# EAGLE schematic 2021-01-12_HALO_Main_Board (EAGLE 9.6.2)
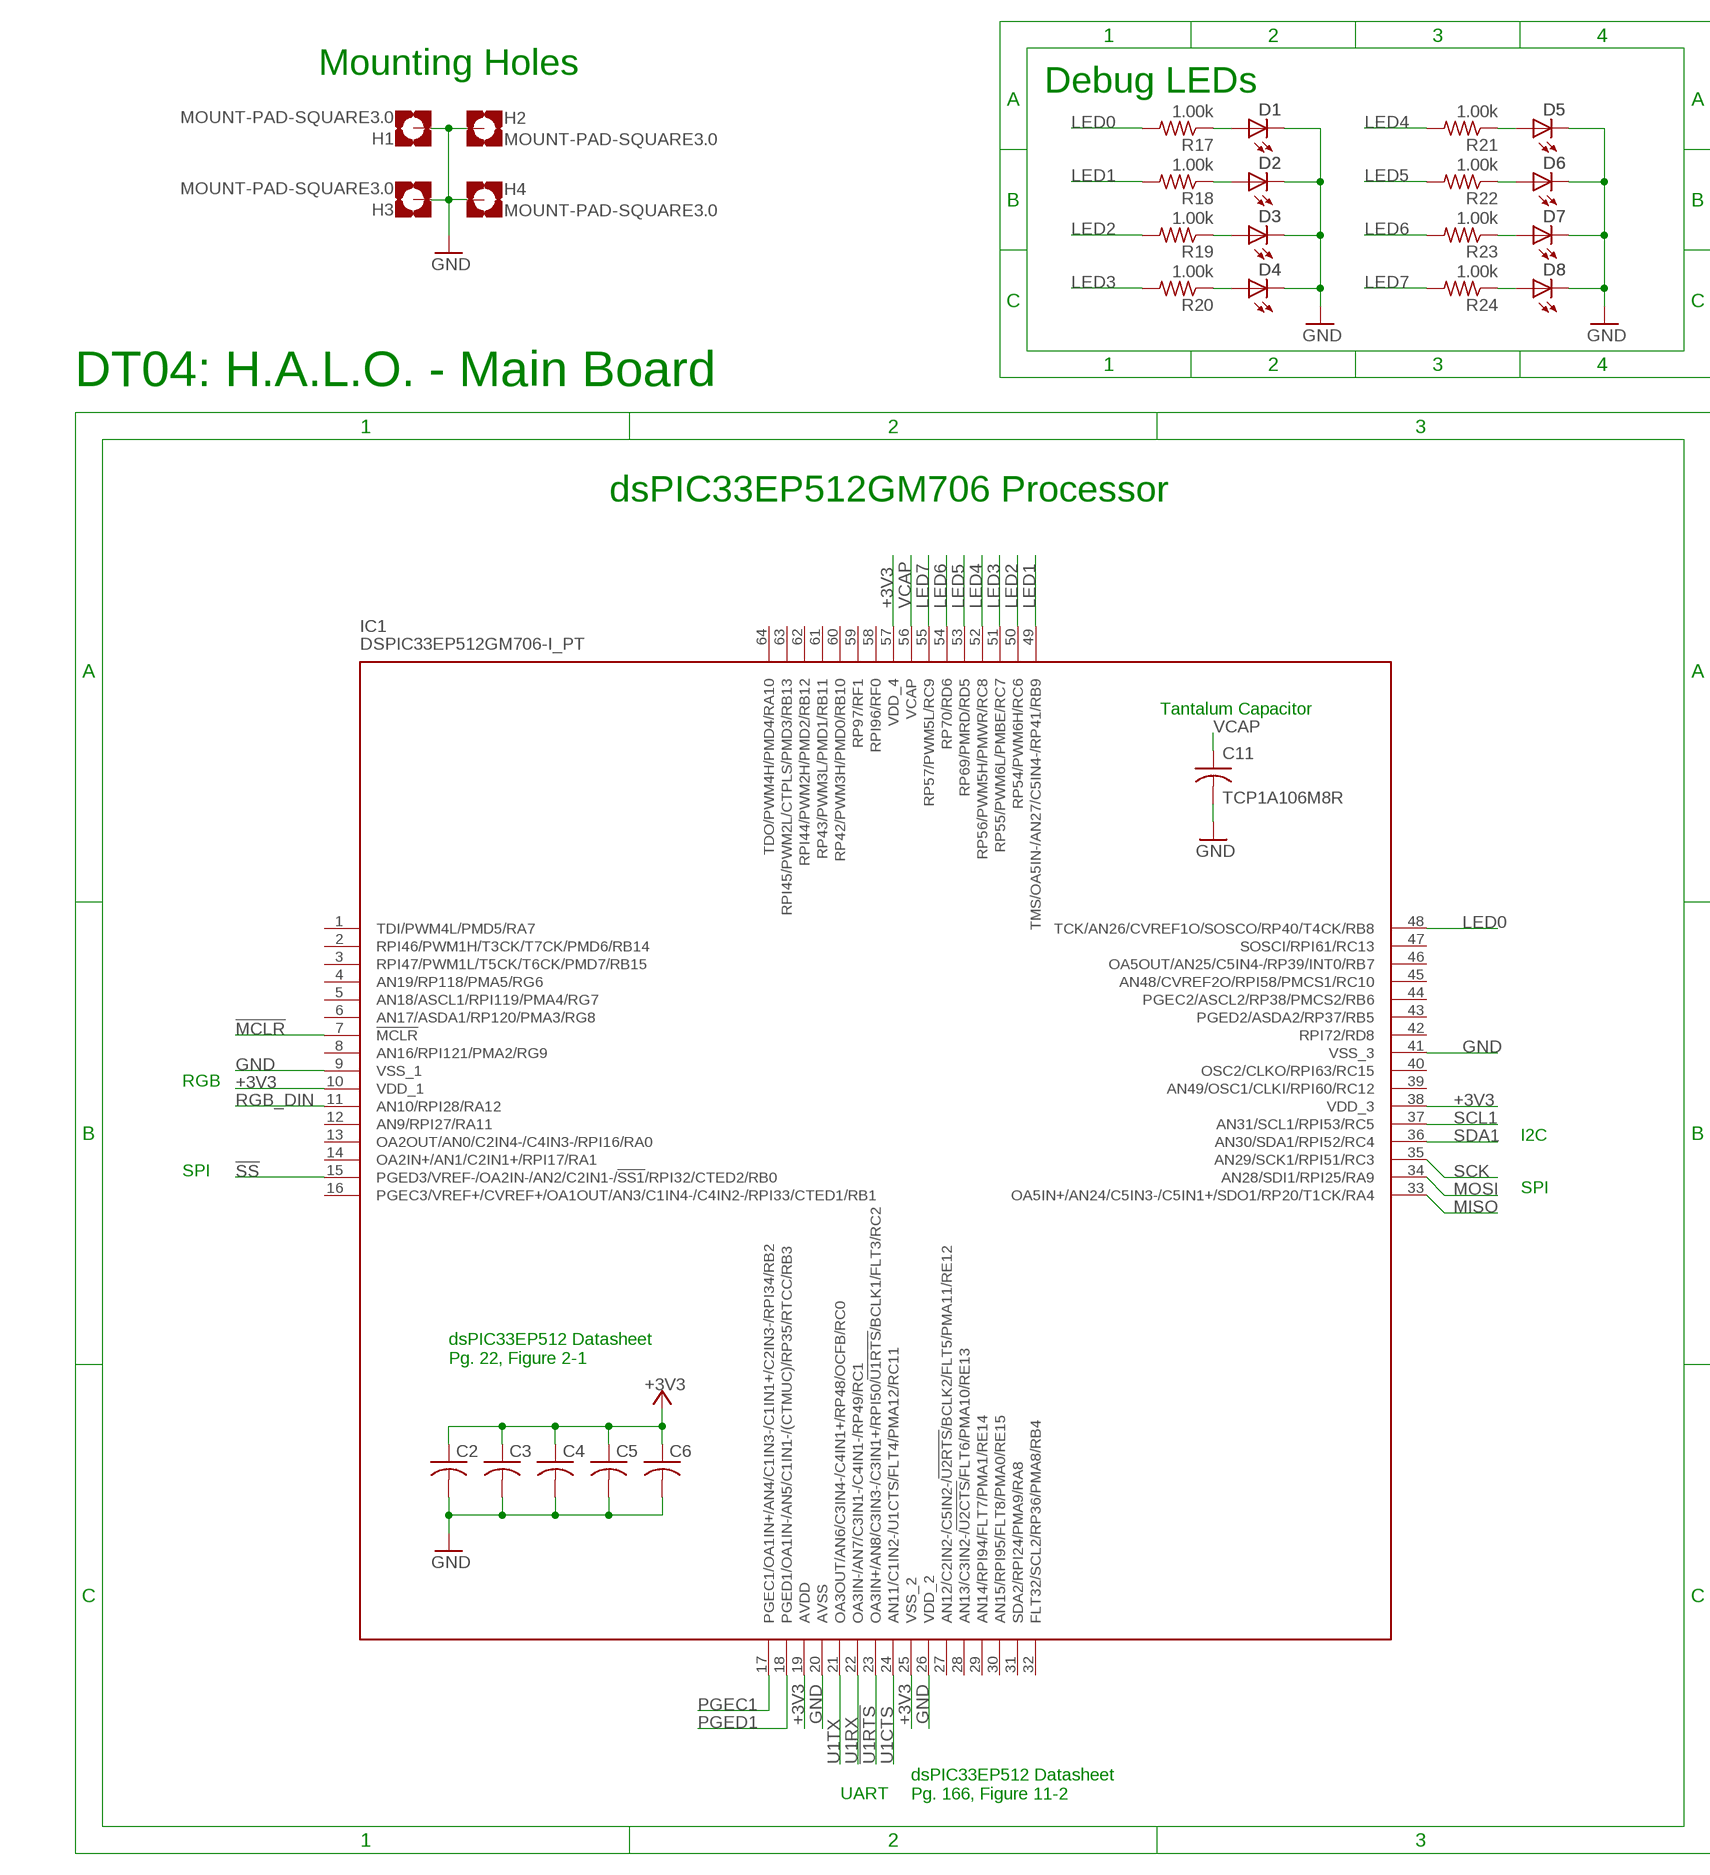
[diagram p0: schematic, sheet 1, part 1 of 2]
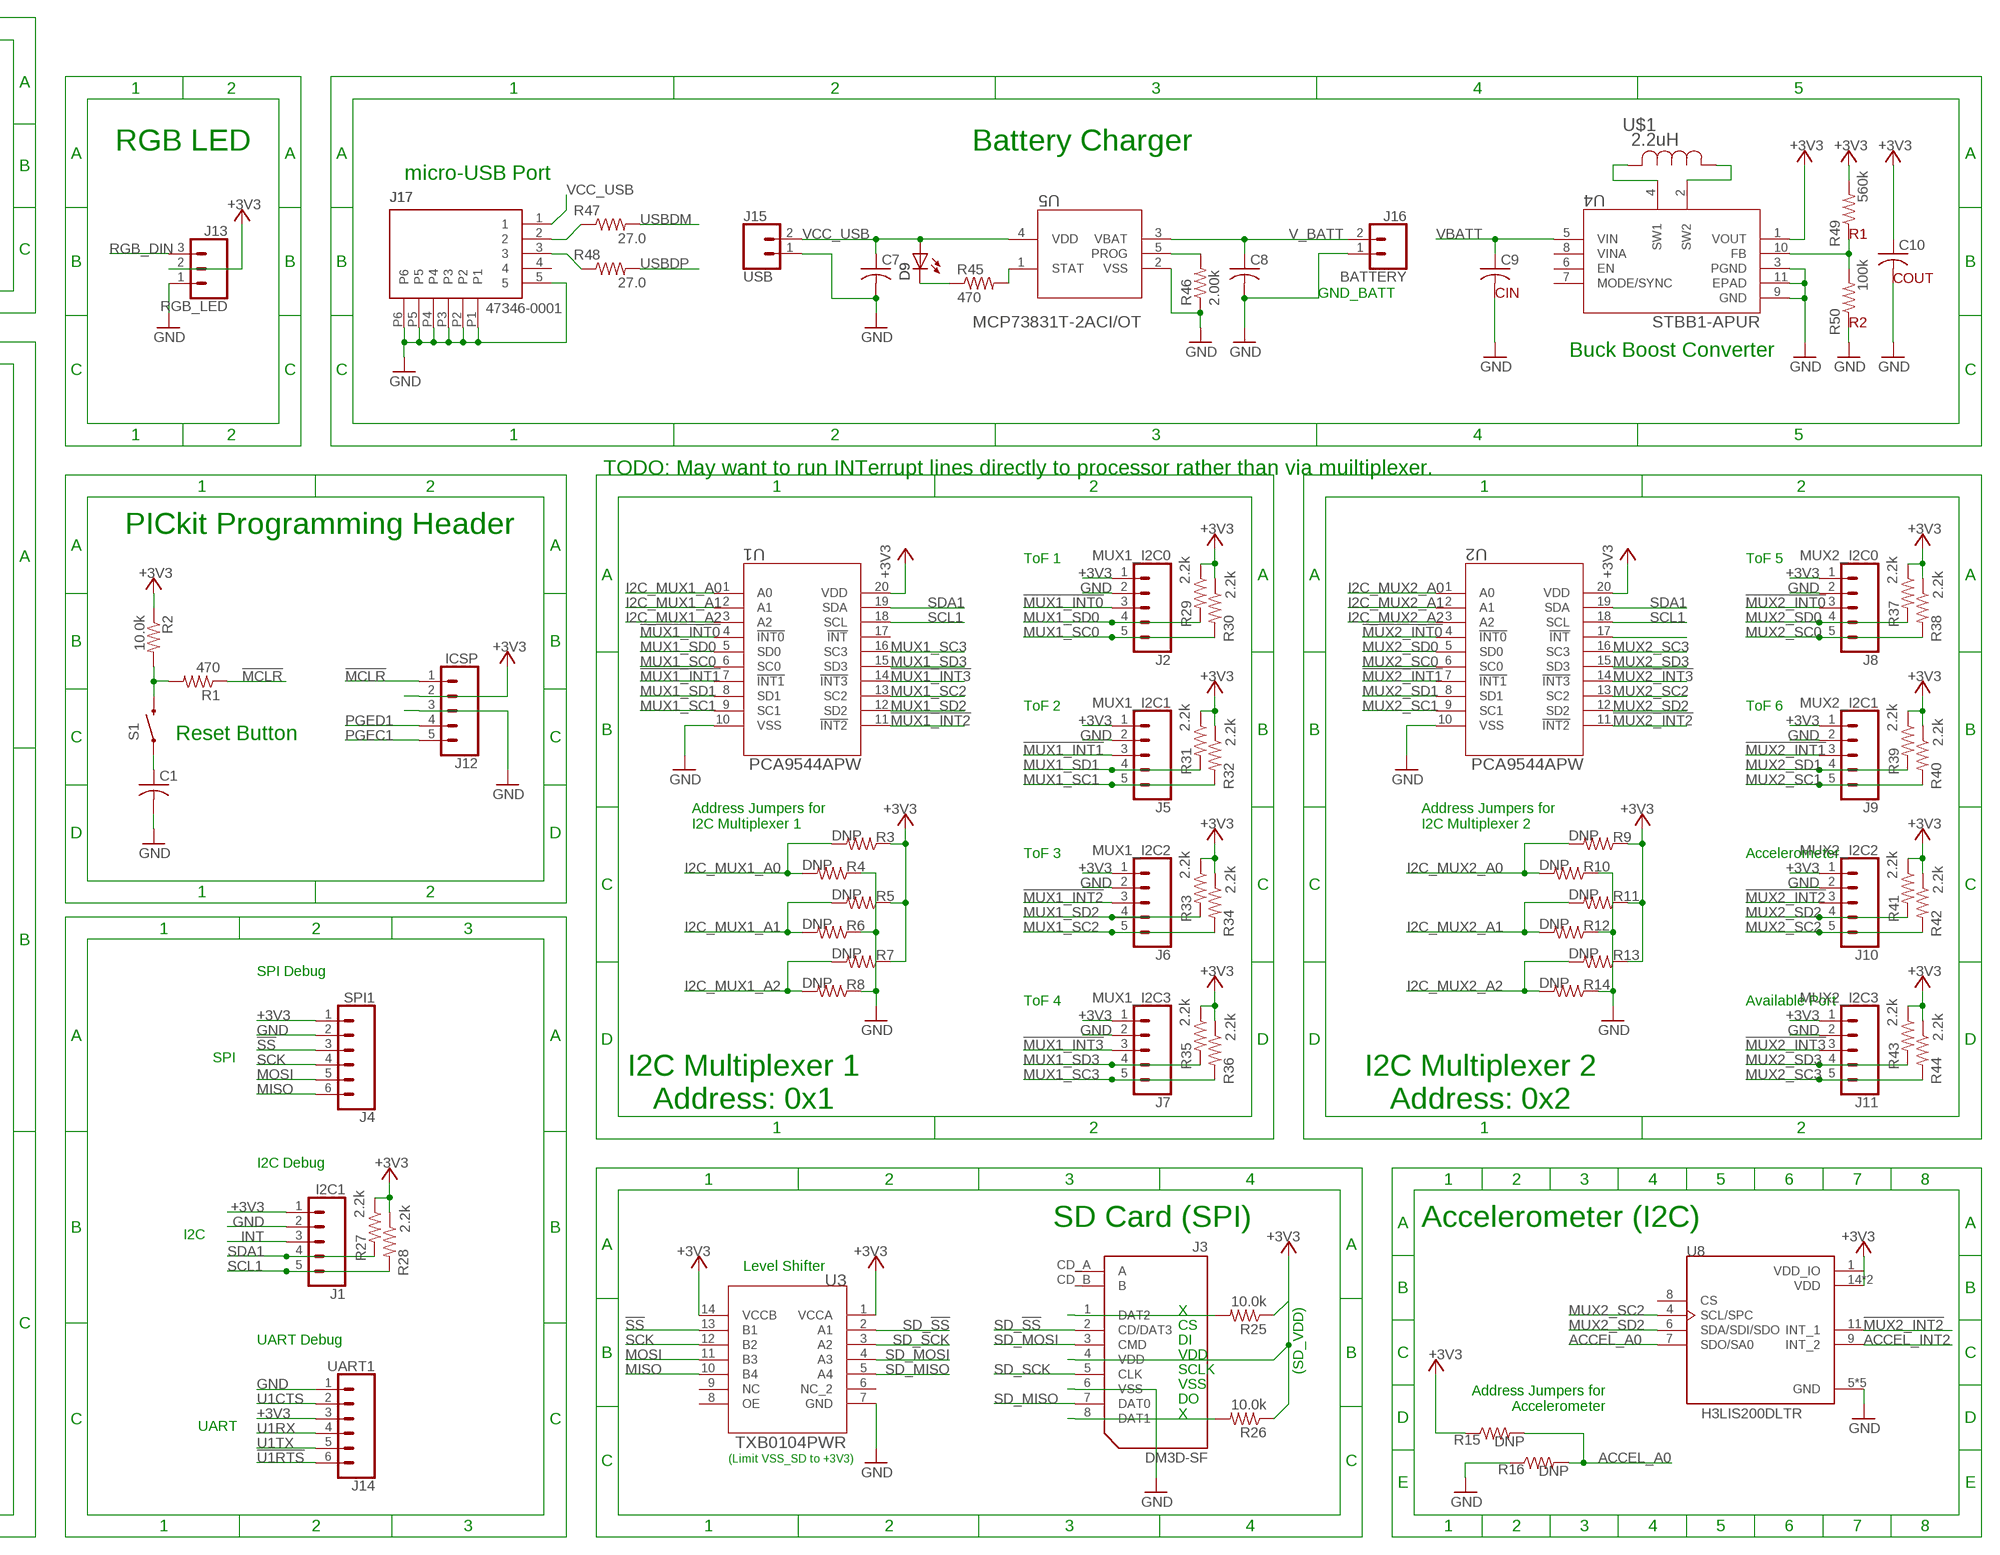
[diagram p1: schematic, sheet 1, part 2 of 2]

## Parts
C1  0.1uF  C-USC0805  [C0805]
C2  0.1uF  C-USC0805  [C0805]
C3  0.1uF  C-USC0805  [C0805]
C4  0.1uF  C-USC0805  [C0805]
C5  0.1uF  C-USC0805  [C0805]
C6  0.1uF  C-USC0805  [C0805]
C7  4.7uF  C-USC0805  [C0805]
C8  4.7uF  C-USC0805  [C0805]
C9  10uF  C-USC0805  [C0805]
C10  22uF  C-USC0805  [C0805]
C11  TCP1A106M8R  [TCP_ROM]
D1  CHIP-LED0805  [CHIP-LED0805]
D2  CHIP-LED0805  [CHIP-LED0805]
D3  CHIP-LED0805  [CHIP-LED0805]
D4  CHIP-LED0805  [CHIP-LED0805]
D5  CHIP-LED0805  [CHIP-LED0805]
D6  CHIP-LED0805  [CHIP-LED0805]
D7  CHIP-LED0805  [CHIP-LED0805]
D8  CHIP-LED0805  [CHIP-LED0805]
D9  CHIP-LED0805  [CHIP-LED0805]
H1  MOUNT-PAD-SQUARE3.0  [3,0-PAD-SQUARE]
H2  MOUNT-PAD-SQUARE3.0  [3,0-PAD-SQUARE]
H3  MOUNT-PAD-SQUARE3.0  [3,0-PAD-SQUARE]
H4  MOUNT-PAD-SQUARE3.0  [3,0-PAD-SQUARE]
IC1  DSPIC33EP512GM706-I_PT  [QFP50P1200X1200X120-64N]
J1  I2C1  CONN_05  [1X05]
J2  MUX1_I2C0  CONN_05  [1X05]
J3  DM3D-SF  AS-ITM-00047  [SD_CARD]
J4  SPI1  CONN_06SILK_FEMALE_PTH  [1X06]
J5  MUX1_I2C1  CONN_05  [1X05]
J6  MUX1_I2C2  CONN_05  [1X05]
J7  MUX1_I2C3  CONN_05  [1X05]
J8  MUX2_I2C0  CONN_05  [1X05]
J9  MUX2_I2C1  CONN_05  [1X05]
J10  MUX2_I2C2  CONN_05  [1X05]
J11  MUX2_I2C3  CONN_05  [1X05]
J12  ICSP  CONN_05  [1X05]
J13  RGB_LED  CONN_03LOCK  [1X03_LOCK]
J14  UART1  CONN_06SILK_FEMALE_PTH  [1X06]
J15  USB  CONN_02  [1X02]
J16  BATTERY  CONN_02  [1X02]
J17  47346-0001  AS-ITM-00021  [MICRO_USB]
R1  470  R-US_R0805  [R0805]
R2  10.0k  R-US_R0805  [R0805]
R3  DNP  R-US_R0805  [R0805]
R4  DNP  R-US_R0805  [R0805]
R5  DNP  R-US_R0805  [R0805]
R6  DNP  R-US_R0805  [R0805]
R7  DNP  R-US_R0805  [R0805]
R8  DNP  R-US_R0805  [R0805]
R9  DNP  R-US_R0805  [R0805]
R10  DNP  R-US_R0805  [R0805]
R11  DNP  R-US_R0805  [R0805]
R12  DNP  R-US_R0805  [R0805]
R13  DNP  R-US_R0805  [R0805]
R14  DNP  R-US_R0805  [R0805]
R15  DNP  R-US_R0805  [R0805]
R16  DNP  R-US_R0805  [R0805]
R17  1.00k  R-US_R0805  [R0805]
R18  1.00k  R-US_R0805  [R0805]
R19  1.00k  R-US_R0805  [R0805]
R20  1.00k  R-US_R0805  [R0805]
R21  1.00k  R-US_R0805  [R0805]
R22  1.00k  R-US_R0805  [R0805]
R23  1.00k  R-US_R0805  [R0805]
R24  1.00k  R-US_R0805  [R0805]
R25  10.0k  R-US_R0805  [R0805]
R26  10.0k  R-US_R0805  [R0805]
R27  2.2k  R-US_R0805  [R0805]
R28  2.2k  R-US_R0805  [R0805]
R29  2.2k  R-US_R0805  [R0805]
R30  2.2k  R-US_R0805  [R0805]
R31  2.2k  R-US_R0805  [R0805]
R32  2.2k  R-US_R0805  [R0805]
R33  2.2k  R-US_R0805  [R0805]
R34  2.2k  R-US_R0805  [R0805]
R35  2.2k  R-US_R0805  [R0805]
R36  2.2k  R-US_R0805  [R0805]
R37  2.2k  R-US_R0805  [R0805]
R38  2.2k  R-US_R0805  [R0805]
R39  2.2k  R-US_R0805  [R0805]
R40  2.2k  R-US_R0805  [R0805]
R41  2.2k  R-US_R0805  [R0805]
R42  2.2k  R-US_R0805  [R0805]
R43  2.2k  R-US_R0805  [R0805]
R44  2.2k  R-US_R0805  [R0805]
R45  470  R-US_R0805  [R0805]
R46  2.00k  R-US_R0805  [R0805]
R47  27.0  R-US_R0805  [R0805]
R48  27.0  R-US_R0805  [R0805]
R49  560k  R-US_R0805  [R0805]
R50  100k  R-US_R0805  [R0805]
S1  SWITCH-MOMENTARY-2SMD-4  [TACTILE_SWITCH_TALL]
U1  PCA9544APW  [SOT360-1_NXP]
U2  PCA9544APW  [SOT360-1_NXP]
U3  TXB0104PWR  [PW14]
U4  STBB1-APUR  [SON_B1-APUR_STM]
U5  MCP73831T-2ACI/OT  [SOT-23-5_MC_MCH]
U8  H3LIS200DLTR  [PQFN50P300X300X100-16N]
U$1  2.2uH  IND  [IND_4028_TDK]

## Nets
!MCLR: IC1.7(!MCLR) J12.1 R1.1
!MUX1_INT0: J2.3 U1.4(!INT0)
!MUX1_INT1: J5.3 U1.7(!INT1)
!MUX1_INT2: J6.3 U1.11(!INT2)
!MUX1_INT3: J7.3 U1.14(!INT3)
!MUX2_INT0: J8.3 U2.4(!INT0)
!MUX2_INT1: J9.3 U2.7(!INT1)
!MUX2_INT2: J10.3 U2.11(!INT2) U8.11(INT_1)
!MUX2_INT3: J11.3 U2.14(!INT3)
!SS: IC1.15(PGED3/VREF-/OA2IN-/AN2/C2IN1-/!SS1!/RPI32/CTED2/RB0) J4.3 U3.13(B1)
!U1RTS: IC1.23(OA3IN+/AN8/C3IN3-/C3IN1+/RPI50/!U1RTS!/BCLK1/FLT3/RC2) J14.6
+3V3: C2.1 C3.1 C4.1 C5.1 C6.1 C10.1 IC1.10(VDD_1) IC1.19(AVDD) IC1.25(VSS_2) IC1.38(VDD_3) IC1.57(VDD_4) J1.1 J2.1 J3.4(VDD) J4.1 J5.1 J6.1 J7.1 J8.1 J9.1 J10.1 J11.1 J12.2 J13.2 J14.3 R2.1 R3.1 R5.1 R7.1 R9.1 R11.1 R13.1 R15.1 R25.1 R26.1 R27.1 R28.1 R29.1 R30.1 R31.1 R32.1 R33.1 R34.1 R35.1 R36.1 R37.1 R38.1 R39.1 R40.1 R41.1 R42.1 R43.1 R44.1 R49.2 U1.20(VDD) U2.20(VDD) U3.1(VCCA) U3.14(VCCB) U4.1(VOUT) U8.1(VDD_IO) U8.14(VDD) U8.15(VDD)
ACCEL_A0: R15.2 R16.2 U8.7(SDO/SA0)
ACCEL_INT2: U8.9(INT_2)
GND: C1.2 C2.2 C3.2 C4.2 C5.2 C6.2 C7.2 C8.2 C9.2 C10.2 C11.2 D1.C D2.C D3.C D4.C D5.C D6.C D7.C D8.C H1.B3,0(MOUNT) H2.B3,0(MOUNT) H3.B3,0(MOUNT) H4.B3,0(MOUNT) IC1.9(VSS_1) IC1.20(AVSS) IC1.26(VDD_2) IC1.41(VSS_3) J1.2 J2.2 J3.6(VSS) J4.2 J5.2 J6.2 J7.2 J8.2 J9.2 J10.2 J11.2 J12.3 J13.1 J14.1 J15.1 J16.1 J17.5 J17.P1 J17.P2 J17.P3 J17.P4 J17.P5 J17.P6 R4.1 R6.1 R8.1 R10.1 R12.1 R14.1 R16.1 R46.1 R50.1 U1.10(VSS) U2.10(VSS) U3.7(GND) U4.3(PGND) U4.9(GND) U4.11(EPAD) U5.2(VSS) U8.5(GND) U8.10(GND) U8.12(GND) U8.13(GND) U8.16(GND)
I2C_MUX1_A0: R3.2 R4.2 U1.1(A0)
I2C_MUX1_A1: R5.2 R6.2 U1.2(A1)
I2C_MUX1_A2: R7.2 R8.2 U1.3(A2)
I2C_MUX2_A0: R9.2 R10.2 U2.1(A0)
I2C_MUX2_A1: R11.2 R12.2 U2.2(A1)
I2C_MUX2_A2: R13.2 R14.2 U2.3(A2)
INT: J1.3
LED0: IC1.48(TCK/AN26/CVREF1O/SOSCO/RP40/T4CK/RB8) R17.2
LED1: IC1.49(TMS/OA5IN-/AN27/C5IN4-/RP41/RB9) R18.2
LED2: IC1.50(RP54/PWM6H/RC6) R19.2
LED3: IC1.51(RP55/PWM6L/PMBE/RC7) R20.2
LED4: IC1.52(RP56/PWM5H/PMWR/RC8) R21.2
LED5: IC1.53(RP69/PMRD/RD5) R22.2
LED6: IC1.54(RP70/RD6) R23.2
LED7: IC1.55(RP57/PWM5L/RC9) R24.2
MISO: IC1.33(OA5IN+/AN24/C5IN3-/C5IN1+/SDO1/RP20/T1CK/RA4) J4.6 U3.10(B4)
MOSI: IC1.34(AN28/SDI1/RPI25/RA9) J4.5 U3.11(B3)
MUX1_SC0: J2.5 R30.2 U1.6(SC0)
MUX1_SC1: J5.5 R32.2 U1.9(SC1)
MUX1_SC2: J6.5 R34.2 U1.13(SC2)
MUX1_SC3: J7.5 R36.2 U1.16(SC3)
MUX1_SD0: J2.4 R29.2 U1.5(SD0)
MUX1_SD1: J5.4 R31.2 U1.8(SD1)
MUX1_SD2: J6.4 R33.2 U1.12(SD2)
MUX1_SD3: J7.4 R35.2 U1.15(SD3)
MUX2_SC0: J8.5 R38.2 U2.6(SC0)
MUX2_SC1: J9.5 R40.2 U2.9(SC1)
MUX2_SC2: J10.5 R42.2 U2.13(SC2) U8.4(SCL/SPC)
MUX2_SC3: J11.5 R44.2 U2.16(SC3)
MUX2_SD0: J8.4 R37.2 U2.5(SD0)
MUX2_SD1: J9.4 R39.2 U2.8(SD1)
MUX2_SD2: J10.4 R41.2 U2.12(SD2) U8.6(SDA/SDI/SDO)
MUX2_SD3: J11.4 R43.2 U2.15(SD3)
N$1: R1.2 R2.2 S1.B2
N$2: C1.1 S1.A2
N$3: J3.8(DAT1) R26.2
N$4: J3.1(DAT2) R25.2
N$5: D1.A R17.1
N$6: J17.2 R47.1
N$7: D2.A R18.1
N$8: D9.C R45.1
N$9: R49.1 R50.2 U4.10(FB)
N$10: D3.A R19.1
N$11: D4.A R20.1
N$12: D5.A R21.1
N$13: D6.A R22.1
N$14: D7.A R23.1
N$15: D8.A R24.1
N$16: R45.2 U5.1(STAT)
N$17: J17.3 R48.1
N$18: U4.4(SW1) U$1.2
N$19: R46.2 U5.5(PROG)
N$20: U4.2(SW2) U$1.1
N$25: U2.17(!INT)
PGEC1: IC1.17(PGEC1/OA1IN+/AN4/C1IN3-/C1IN1+/C2IN3-/RPI34/RB2) J12.5
PGED1: IC1.18(PGED1/OA1IN-/AN5/C1IN1-/(CTMUC)/RP35/RTCC/RB3) J12.4
RGB_DIN: IC1.11(AN10/RPI28/RA12) J13.3
SCK: IC1.35(AN29/SCK1/RPI51/RC3) J4.4 U3.12(B2)
SCL1: IC1.37(AN31/SCL1/RPI53/RC5) J1.5 R28.2 U1.18(SCL) U2.18(SCL)
SD_!SS: J3.2(CD/DAT3) U3.2(A1)
SD_MISO: J3.7(DAT0) U3.5(A4)
SD_MOSI: J3.3(CMD) U3.4(A3)
SD_SCK: J3.5(CLK) U3.3(A2)
SDA1: IC1.36(AN30/SDA1/RPI52/RC4) J1.4 R27.2 U1.19(SDA) U2.19(SDA)
U1CTS: IC1.24(AN11/C1IN2-/U1CTS/FLT4/PMA12/RC11) J14.2
U1RX: IC1.22(OA3IN-/AN7/C3IN1-/C4IN1-/RP49/RC1) J14.4
U1TX: IC1.21(OA3OUT/AN6/C3IN4-/C4IN1+/RP48/OCFB/RC0) J14.5
USBDM: R47.2
USBDP: R48.2
V_BATT: C8.1 J16.2 U5.3(VBAT)
VBATT: C9.1 U4.5(VIN)
VCAP: C11.1 IC1.56(VCAP)
VCC_USB: C7.1 D9.A J15.2 J17.1 U5.4(VDD)
Unconnected: IC1.1(TDI/PWM4L/PMD5/RA7) IC1.2(RPI46/PWM1H/T3CK/T7CK/PMD6/RB14) IC1.3(RPI47/PWM1L/T5CK/T6CK/PMD7/RB15) IC1.4(AN19/RP118/PMA5/RG6) IC1.5(AN18/ASCL1/RPI119/PMA4/RG7) IC1.6(AN17/ASDA1/RP120/PMA3/RG8) IC1.8(AN16/RPI121/PMA2/RG9) IC1.12(AN9/RPI27/RA11) IC1.13(OA2OUT/AN0/C2IN4-/C4IN3-/RPI16/RA0) IC1.14(OA2IN+/AN1/C2IN1+/RPI17/RA1) IC1.16(PGEC3/VREF+/CVREF+/OA1OUT/AN3/C1IN4-/C4IN2-/RPI33/CTED1/RB1) IC1.27(AN12/C2IN2-/C5IN2-/!U2RTS!/BCLK2/FLT5/PMA11/RE12) IC1.28(AN13/C3IN2-/!U2CTS!/FLT6/PMA10/RE13) IC1.29(AN14/RPI94/FLT7/PMA1/RE14) IC1.30(AN15/RPI95/FLT8/PMA0/RE15) IC1.31(SDA2/RPI24/PMA9/RA8) IC1.32(FLT32/SCL2/RP36/PMA8/RB4) IC1.39(AN49/OSC1/CLKI/RPI60/RC12) IC1.40(OSC2/CLKO/RPI63/RC15) IC1.42(RPI72/RD8) IC1.43(PGED2/ASDA2/RP37/RB5) IC1.44(PGEC2/ASCL2/RP38/PMCS2/RB6) IC1.45(AN48/CVREF2O/RPI58/PMCS1/RC10) IC1.46(OA5OUT/AN25/C5IN4-/RP39/INT0/RB7) IC1.47(SOSCI/RPI61/RC13) IC1.58(RPI96/RF0) IC1.59(RP97/RF1) IC1.60(RP42/PWM3H/PMD0/RB10) IC1.61(RP43/PWM3L/PMD1/RB11) IC1.62(RPI44/PWM2H/PMD2/RB12) IC1.63(RPI45/PWM2L/CTPLS/PMD3/RB13) IC1.64(TDO/PWM4H/PMD4/RA10) J3.CD_A(A) J3.CD_B(B) J17.4 U1.17(!INT) U3.6(NC_2) U3.8(OE) U3.9(NC) U4.6(EN) U4.7(MODE/SYNC) U8.8(CS)

## Notes on the sheet
- Mounting Holes
- Debug LEDs
- RGB LED | Battery Charger
- micro-USB Port
- R1
- COUT
- GND_BATT | CIN
- DT04: H.A.L.O. - Main Board
- R2
- Buck Boost Converter
- dsPIC33EP512GM706 Processor
- TODO: May want to run INTerrupt lines directly to processor rather than via muiltiplexer.
- PICkit Programming Header
- ToF 1 | ToF 5
- Tantalum Capacitor
- ToF 2 | ToF 6
- Reset Button
- Address Jumpers for
  I2C Multiplexer 1
- Address Jumpers for
  I2C Multiplexer 2
- ToF 3 | Accelerometer
- ┏ 
  RGB
       ┃
       ┗
- ┓ 
   I2C
  ┛
- SPI Debug
- ┏ 
  SPI
     ┗
- ToF 4 | Available Port
- ┓ 
   SPI
  ┃ 
  ┛
- ┏ 
     ┃
     ┃
  SPI
     ┃
     ┃
     ┗
- I2C Multiplexer 1
  Address: 0x1
- I2C Multiplexer 2
  Address: 0x2
- dsPIC33EP512 Datasheet
  Pg. 22, Figure 2-1
- I2C Debug
- SD Card (SPI) | Accelerometer (I2C)
- Level Shifter
- ┏ 
     ┃
  I2C
     ┃
     ┃
     ┗
- X
- CS
- UART Debug | DI
- VDD
- SCLK | (SD_VDD)
- VSS
- DO
- Address Jumpers for
  Accelerometer
- X
- (Limit VSS_SD to +3V3)
- ┏ 
        ┃
        ┃
  UART
        ┃
        ┃
        ┗
- ┗ UART┛
- dsPIC33EP512 Datasheet
  Pg. 166, Figure 11-2

## Power pins joined to a net without a drawn wire
VINA: U4.8(VINA)

## Library data of the parts
C1-C10 = rcl:C-US: CAPACITOR, American symbol
C11 = HALO_Tant_Cap_Library:TCP1A106M8R; BUILT_BY: EMA_UL_Team; MANUFACTURER_PART_NUMBER: TCP1A106M8R; SOURCELIBRARY: Rohm_2014-12-31; VENDOR: ROHM Semiconductor
D1-D9 = UA_NASA_RMC-Diodes:CHIP-LED0805
H1-H4 = holes:MOUNT-PAD-SQUARE: MOUNTING PAD, square
IC1 = SamacSys_Parts:DSPIC33EP512GM706-I_PT: Microchip DSPIC33EP512GM706-I/PT, 16bit dsPIC Microcontroller, 60MHz, 512 kB Flash, 64-Pin TQFP Source: Datasheet <http://www.microchip.com/mymicrochip/filehandler.aspx?ddocname=en561674>; ARROW_PART_NUMBER: DSPIC33EP512GM706-I/PT; ARROW_PRICE-STOCK: https://www.arrow.com/en/products/dspic33ep512gm706-ipt/microchip-technology; DESCRIPTION: Microchip DSPIC33EP512GM706-I/PT, 16bit dsPIC Microcontroller, 60MHz, 512 kB Flash, 64-Pin TQFP; HEIGHT: 1.2mm; MANUFACTURER_NAME: Microchip; MANUFACTURER_PART_NUMBER: DSPIC33EP512GM706-I/PT; MOUSER_PART_NUMBER: 579-512GM706-I/PT; MOUSER_PRICE-STOCK: https://www.mouser.com/Search/Refine.aspx?Keyword=579-512GM706-I%2FPT
J1 J2 J5-J12 = SparkFun-Connectors:CONN_05: Multi connection point. Often used as Generic Header-pin footprint for 0.1 inch spaced/style header connections On any of the 0.1 inch spaced packages, you can populate with these: Break Away Headers - Straight <https://www.sparkfun.com/products/116> (PRT-00116) Break Away Male Headers - Right Angle <https://www.sparkfun.com/products/553> (PRT-00553) Female Headers <https://www.sparkfun.com/products/115> (PRT-00115) Break Away Headers - Machine Pin <https://www.sparkfun.com/products/117> (PRT-00117) Break Away Female Headers - Swiss Machine Pin <https://www.sparkfun.com/products/743> (PRT-00743) For SCREWTERMINALS and SPRING TERMINALS visit here: Screw Terimnals on SparkFun.com <https://www.sparkfun.com/search/results?term=Screw+Terminals> (5mm/3.5mm/2.54mm spacing) This device is also useful as a general connection point to wire up your design to another part of your project. Our various solder wires solder well into these plated through hole pads. Hook-Up Wire - Assortment (Stranded, 22 AWG) <https://www.sparkfun.com/products/11375> (PRT-11375) Hook-Up Wire - Assortment (Solid Core, 22 AWG) <https://www.sparkfun.com/products/11367> (PRT-11367) View the entire wire category on our website here <https://www.sparkfun.com/categories/141> Special notes: Molex polarized connector foot print use with SKU : PRT-08231 with associated crimp pins and housings. 1MM SMD Version SKU: PRT-10208
J3 = tinycircuits:AS-ITM-00047: CONN MICRO SD R/A PUSH-PULL SMD; PARTNO: AS-ITM-00047; PNPROTATION: 270
J4 J14 = SparkFun-Connectors:CONN_06: Multi connection point. Often used as Generic Header-pin footprint for 0.1 inch spaced/style header connections On any of the 0.1 inch spaced packages, you can populate with these: Break Away Headers - Straight <https://www.sparkfun.com/products/116> (PRT-00116) Break Away Male Headers - Right Angle <https://www.sparkfun.com/products/553> (PRT-00553) Female Headers <https://www.sparkfun.com/products/115> (PRT-00115) Break Away Headers - Machine Pin <https://www.sparkfun.com/products/117> (PRT-00117) Break Away Female Headers - Swiss Machine Pin <https://www.sparkfun.com/products/743> (PRT-00743) Arduino Stackable Header - 6 Pin <https://www.sparkfun.com/products/9280> (PRT-09280) For SCREWTERMINALS and SPRING TERMINALS visit here: Screw Terimnals on SparkFun.com <https://www.sparkfun.com/search/results?term=Screw+Terminals> (5mm/3.5mm/2.54mm spacing) This device is also useful as a general connection point to wire up your design to another part of your project. Our various solder wires solder well into these plated through hole pads. Hook-Up Wire - Assortment (Stranded, 22 AWG) <https://www.sparkfun.com/products/11375> (PRT-11375) Hook-Up Wire - Assortment (Solid Core, 22 AWG) <https://www.sparkfun.com/products/11367> (PRT-11367) View the entire wire category on our website here <https://www.sparkfun.com/categories/141>; PROD_ID: CONN-08437
J13 = SparkFun-Connectors:CONN_03: Multi connection point. Often used as Generic Header-pin footprint for 0.1 inch spaced/style header connections On any of the 0.1 inch spaced packages, you can populate with these: Break Away Headers - Straight <https://www.sparkfun.com/products/116> (PRT-00116) Break Away Male Headers - Right Angle <https://www.sparkfun.com/products/553> (PRT-00553) Female Headers <https://www.sparkfun.com/products/115> (PRT-00115) Break Away Headers - Machine Pin <https://www.sparkfun.com/products/117> (PRT-00117) Break Away Female Headers - Swiss Machine Pin <https://www.sparkfun.com/products/743> (PRT-00743) Stackable Header - 3 Pin (Female, 0.1") <https://www.sparkfun.com/products/13875> (PRT-13875) For SCREWTERMINALS and SPRING TERMINALS visit here: Screw Terimnals on SparkFun.com <https://www.sparkfun.com/search/results?term=Screw+Terminals> (5mm/3.5mm/2.54mm spacing) This device is also useful as a general connection point to wire up your design to another part of your project. Our various solder wires solder well into these plated through hole pads. Hook-Up Wire - Assortment (Stranded, 22 AWG) <https://www.sparkfun.com/products/11375> (PRT-11375) Hook-Up Wire - Assortment (Solid Core, 22 AWG) <https://www.sparkfun.com/products/11367> (PRT-11367) View the entire wire category on our website here <https://www.sparkfun.com/categories/141> Special notes: Molex polarized connector foot print use with SKU : PRT-08232 with associated crimp pins and housings.
J15 J16 = SparkFun-Connectors:CONN_02: Multi connection point. Often used as Generic Header-pin footprint for 0.1 inch spaced/style header connections On any of the 0.1 inch spaced packages, you can populate with these: Break Away Headers - Straight <https://www.sparkfun.com/products/116> (PRT-00116) Break Away Male Headers - Right Angle <https://www.sparkfun.com/products/553> (PRT-00553) Female Headers <https://www.sparkfun.com/products/115> (PRT-00115) Break Away Headers - Machine Pin <https://www.sparkfun.com/products/117> (PRT-00117) Break Away Female Headers - Swiss Machine Pin <https://www.sparkfun.com/products/743> (PRT-00743) For SCREWTERMINALS and SPRING TERMINALS visit here: Screw Terimnals on SparkFun.com <https://www.sparkfun.com/search/results?term=Screw+Terminals> (5mm/3.5mm/2.54mm spacing) This device is also useful as a general connection point to wire up your design to another part of your project. Our various solder wires solder well into these plated through hole pads. Hook-Up Wire - Assortment (Stranded, 22 AWG) <https://www.sparkfun.com/products/11375> (PRT-11375) Hook-Up Wire - Assortment (Solid Core, 22 AWG) <https://www.sparkfun.com/products/11367> (PRT-11367) View the entire wire category on our website here <https://www.sparkfun.com/categories/141> Special notes: Molex polarized connector foot print use with: PRT-08233 with associated crimp pins and housings. 2.54_SCREWTERM for use with PRT-10571. 3.5mm Screw Terminal footprints for PRT-08084 5mm Screw Terminal footprints for use with PRT-08432
J17 = tinycircuits:AS-ITM-00021: CONN RCPT 5POS MICRO USB R/A; PARTNO: AS-ITM-00021; PNPROTATION: 90
R1-R50 = rcl:R-US_: RESISTOR, American symbol
S1 = UA_NASA_RMC-Switches:SWITCH-MOMENTARY-2: Various NO switches- pushbuttons, reed, etc Series: PTS645; PROD_ID: SWCH-11966
U1 U2 = I2C_Multiplexer:PCA9544APW; BUILT_BY: EMA_UL_Team; MANUFACTURER_PART_NUMBER: PCA9544APW; SOURCELIBRARY: NXP_2011-11-10; VENDOR: NXP
U3 = Level_Shifter_TXB0104PWR:TXB0104PWR; DATASHEET_URL: http://www.ti.com/lit/gpn/TXB0104; DESCRIPTION: 4-Bit Bidirectional Voltage-Level Translator with Auto Direction Sensing and +/-15 kV ESD Protect; FAMILY_NAME: AUTO DIRECTION SENSING DUAL SUPPLY TRANSLATOR; GENERIC_PART_NUMBER: TXB0104; INDUSTRY_STD_PKG_TYPE: TSSOP; MANUFACTURER: Texas Instruments; MANUFACTURER_PART_NUMBER: TXB0104PWR; PACKAGE_DESIGNATOR: PW; PIN_COUNT: 14; VENDOR: Texas Instruments
U4 = HALO_Buck_Boost:STBB1-APUR; BUILT_BY: EMA_Matt; DATASHEET: https://datasheet.octopart.com/STBB1-APUR-STMicroelectronics-datasheet-10837531.pdf; MANUFACTURER_PART_NUMBER: STBB1-APUR; SOURCELIBRARY: Updates_to_database_2020-11-13; VENDOR: STMicroelectronics
U5 = HALO_Batt_Charger:MCP73831T-2ACI/OT; BUILT_BY: EMA_UL_Team; MANUFACTURER_PART_NUMBER: MCP73831T-2ACI/OT; SOURCELIBRARY: Microchip_2011-05-13; VENDOR: Microchip
U8 = H3LIS200DLTR:H3LIS200DLTR: H3LIS200DL Series 3.6 V 400 Hz Low-Power 3-Axis Digital Accelerometer -TFLGA-16L; DESCRIPTION: Accelerometer X, Y, Z Axis ±100g, ±200g 25Hz ~ 500Hz 16-TFLGA (3x3); DIGI-KEY_PART_NUMBER: 497-15698-1-ND; MF: STMicroelectronics; MP: H3LIS200DLTR; PACKAGE: TFLGA-16 STMicroelectronics; PURCHASE-URL: https://pricing.snapeda.com/search/part/H3LIS200DLTR/?ref=eda
U$1 = HALO_L_Buck_Boost:IND